# EAGLE design SideXSolarPanel (EAGLE 6.6.0)
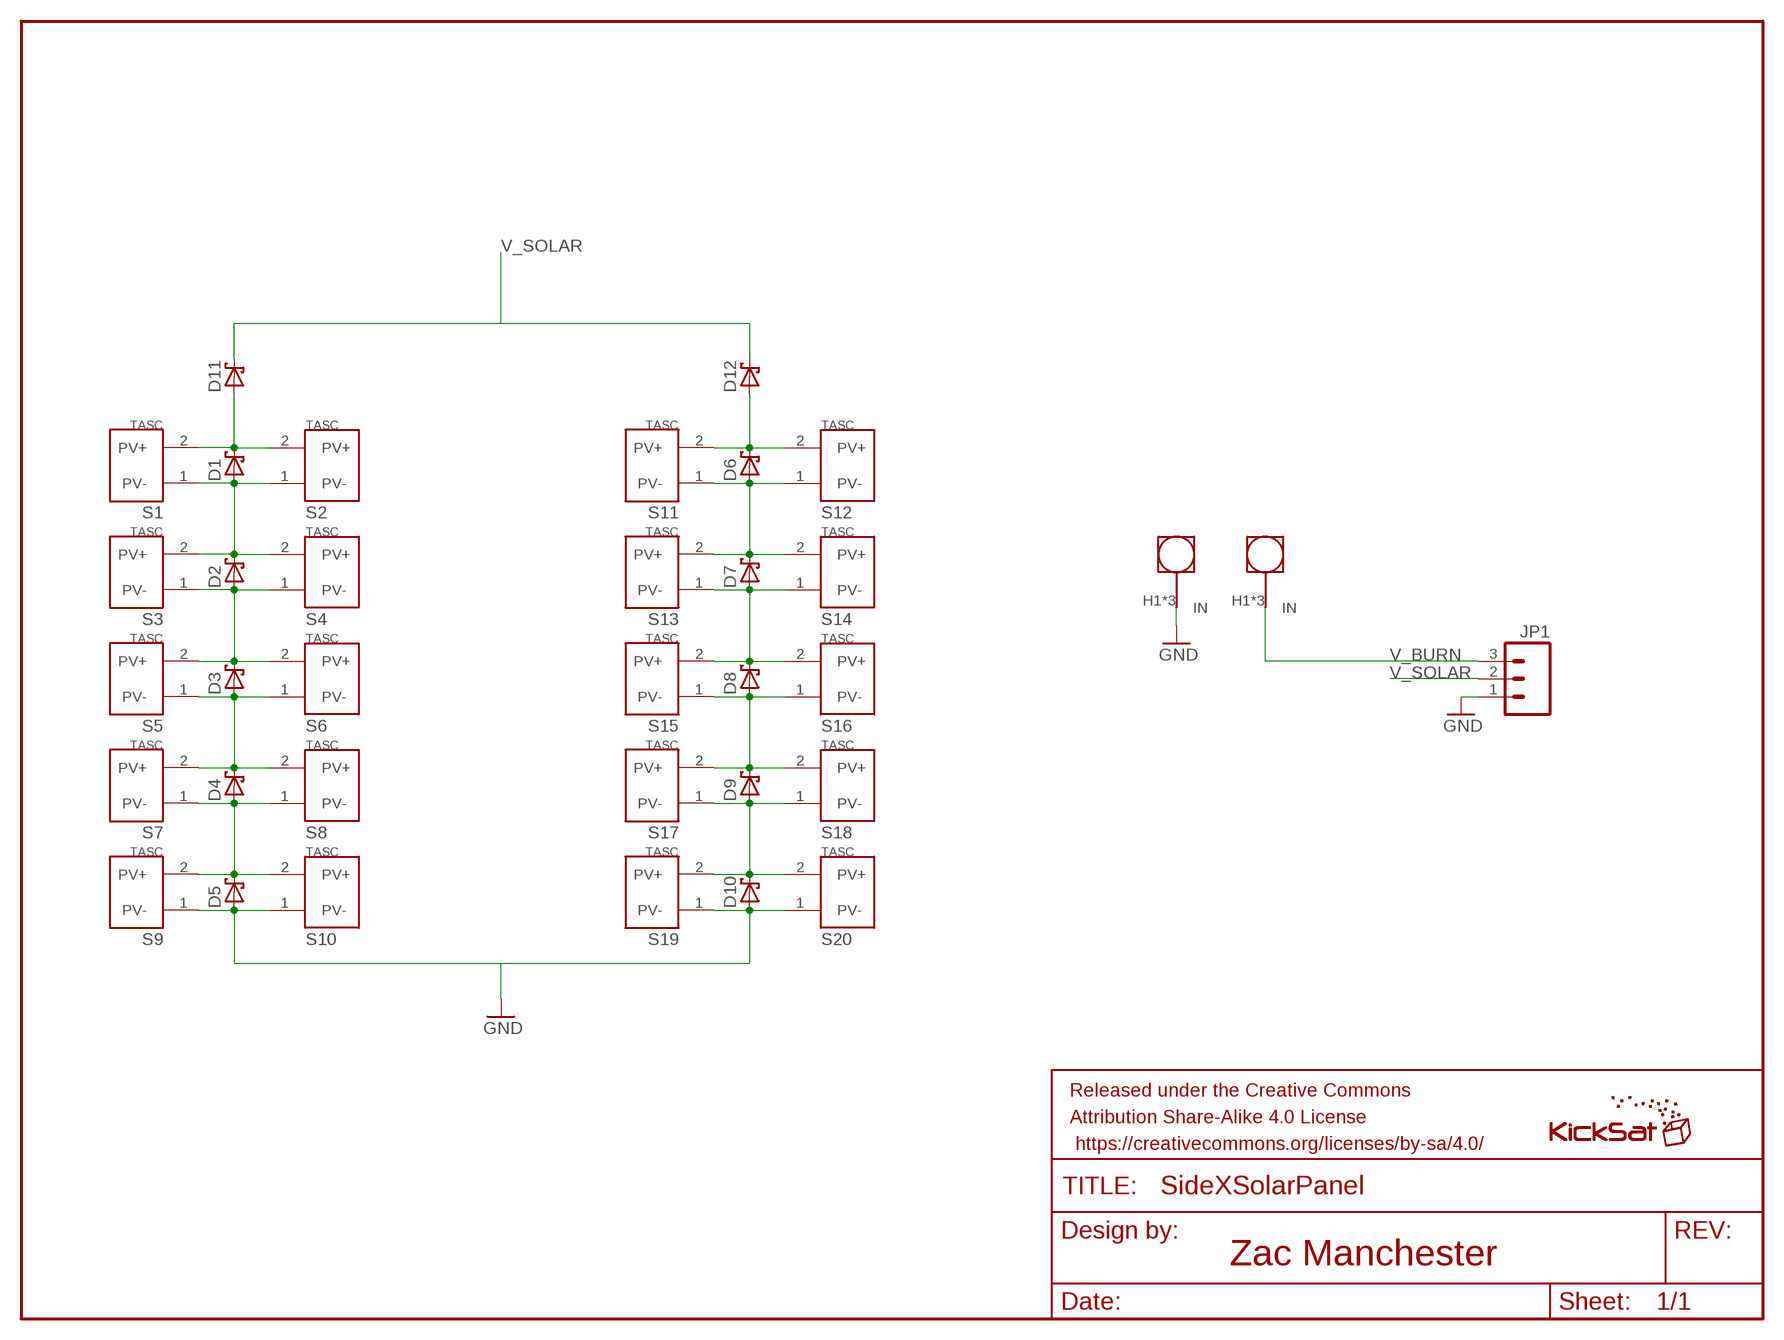
[diagram p0: schematic, sheet 1]

## Parts
D1  SB_DIODE  [SB_DIODE]
D2  SB_DIODE  [SB_DIODE]
D3  SB_DIODE  [SB_DIODE]
D4  SB_DIODE  [SB_DIODE]
D5  SB_DIODE  [SB_DIODE]
D6  SB_DIODE  [SB_DIODE]
D7  SB_DIODE  [SB_DIODE]
D8  SB_DIODE  [SB_DIODE]
D9  SB_DIODE  [SB_DIODE]
D10  SB_DIODE  [SB_DIODE]
D11  SB_DIODE  [SB_DIODE]
D12  SB_DIODE  [SB_DIODE]
FRAME1  FRAME-LETTER  [CREATIVE_COMMONS]
JP1  M03POLAR_LOCK  [MOLEX-1X3_LOCK]
S1  SOLAR_CELL  [SOLAR_CELL]
S2  SOLAR_CELL  [SOLAR_CELL]
S3  SOLAR_CELL  [SOLAR_CELL]
S4  SOLAR_CELL  [SOLAR_CELL]
S5  SOLAR_CELL  [SOLAR_CELL]
S6  SOLAR_CELL  [SOLAR_CELL]
S7  SOLAR_CELL  [SOLAR_CELL]
S8  SOLAR_CELL  [SOLAR_CELL]
S9  SOLAR_CELL  [SOLAR_CELL]
S10  SOLAR_CELL  [SOLAR_CELL]
S11  SOLAR_CELL  [SOLAR_CELL]
S12  SOLAR_CELL  [SOLAR_CELL]
S13  SOLAR_CELL  [SOLAR_CELL]
S14  SOLAR_CELL  [SOLAR_CELL]
S15  SOLAR_CELL  [SOLAR_CELL]
S16  SOLAR_CELL  [SOLAR_CELL]
S17  SOLAR_CELL  [SOLAR_CELL]
S18  SOLAR_CELL  [SOLAR_CELL]
S19  SOLAR_CELL  [SOLAR_CELL]
S20  SOLAR_CELL  [SOLAR_CELL]
U$1  BURNER  [BURNER]
U$2  BURNER  [BURNER]
U$3  KICKSAT_LOGO  [KICKSAT_LOGO]

## Nets
GND: D5.POS D10.POS JP1.1 S9.1(PV-) S10.1(PV-) S19.1(PV-) S20.1(PV-) U$2.H1(IN) U$2.H2(IN) U$2.H3(IN)
N$1: D6.POS D7.NEG S11.1(PV-) S12.1(PV-) S13.2(PV+) S14.2(PV+)
N$5: D6.NEG D12.POS S11.2(PV+) S12.2(PV+)
N$7: D7.POS D8.NEG S13.1(PV-) S14.1(PV-) S15.2(PV+) S16.2(PV+)
N$9: D1.NEG D11.POS S1.2(PV+) S2.2(PV+)
N$36: D8.POS D9.NEG S15.1(PV-) S16.1(PV-) S17.2(PV+) S18.2(PV+)
N$37: D2.POS D3.NEG S3.1(PV-) S4.1(PV-) S5.2(PV+) S6.2(PV+)
N$39: D3.POS D4.NEG S5.1(PV-) S6.1(PV-) S7.2(PV+) S8.2(PV+)
N$41: D9.POS D10.NEG S17.1(PV-) S18.1(PV-) S19.2(PV+) S20.2(PV+)
N$45: D1.POS D2.NEG S1.1(PV-) S2.1(PV-) S3.2(PV+) S4.2(PV+)
N$50: D4.POS D5.NEG S7.1(PV-) S8.1(PV-) S9.2(PV+) S10.2(PV+)
V_BURN: JP1.3 U$1.H1(IN) U$1.H2(IN) U$1.H3(IN)
V_SOLAR: D11.NEG D12.NEG JP1.2

## Notes on the sheet
- Zac Manchester

## Library data of the parts
D1-D12 = Solar:SB_DIODE
FRAME1 = SparkFun-Aesthetics:FRAME-LETTER: Schematic Frame Standard 8.5x11 US Letter frame
JP1 = SparkFun-Connectors:M03: Header 3 Standard 3-pin 0.1" header. Use with straight break away headers (SKU : PRT-00116), right angle break away headers (PRT-00553), swiss pins (PRT-00743), machine pins (PRT-00117), and female headers (PRT-00115). Molex polarized connector foot print use with SKU : PRT-08232 with associated crimp pins and housings.
S1-S20 = Solar:SOLAR_CELL
U$1 U$2 = Burner:BURNER
U$3 = KickSat-Logo:KICKSAT_LOGO

## Board
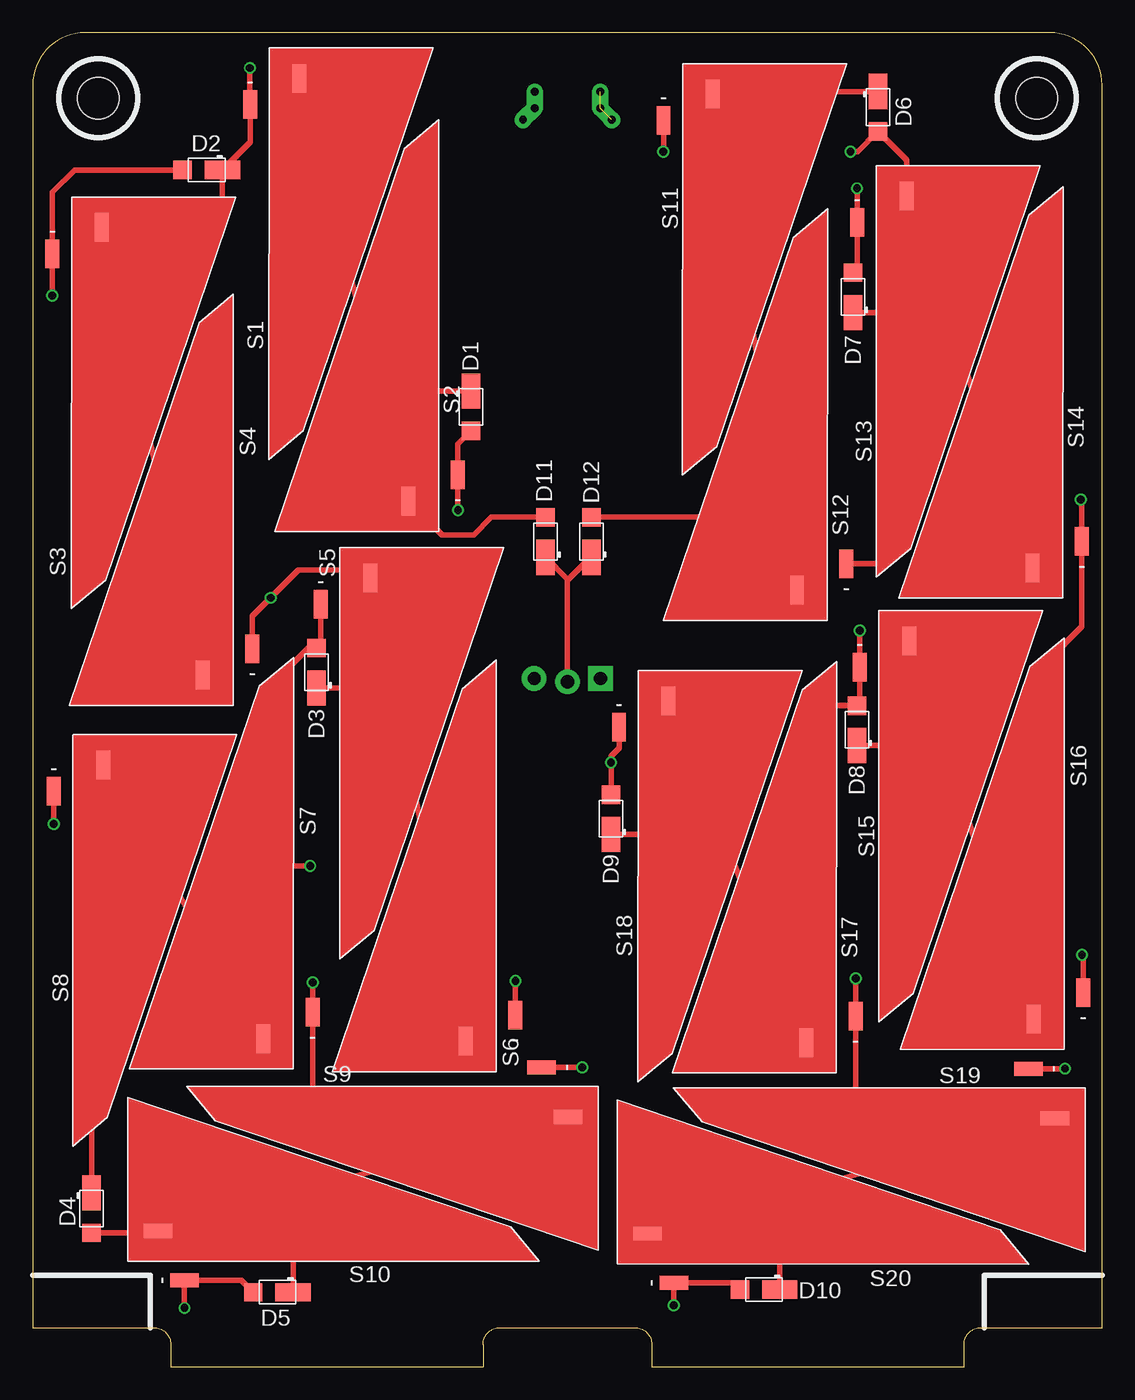
[diagram p1: board, top side]
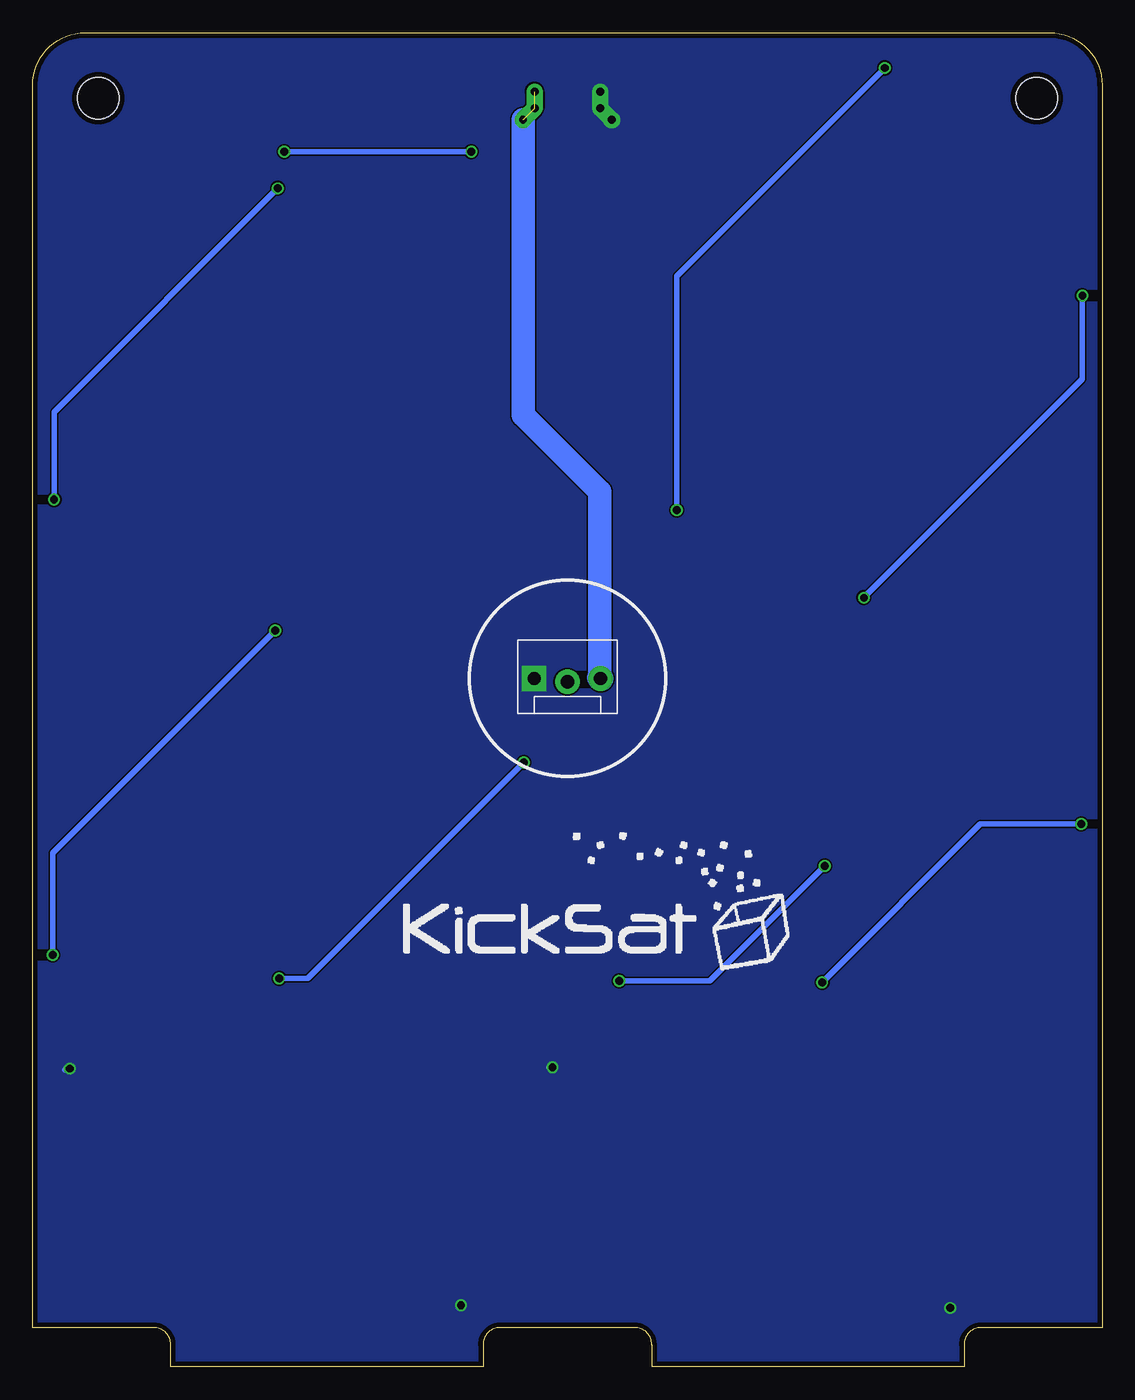
[diagram p2: board, bottom side, seen from below]

Size 81.73 x 102 mm. Coordinates in mm from the lower left corner, seen from the top.
Outline: 81.73,3 81.73,98 arc90 77.73,102 4,102 arc90 0,98 0,3 9.25,3 arc-90 10.55,1.7 10.55,0 34.41,0 34.41,1.7 arc-90 35.72,3 46.02,3 arc-90 47.31,1.7 47.31,0 71.18,0 71.18,1.7 arc-90 72.48,3 81.73,3
Copper layers (1*2*15*16): Top 0.035559375mm / dielectric 0.17018125mm / Route2 0.01778125mm / dielectric 47mil / Route15 0.01778125mm / dielectric 0.17018125mm / Bottom 0.035559375mm
Design rules "OSHPark-4layer": minimum track width 5mil, minimum drill 10mil, track to track 5mil, track to pad 5mil, pad to pad 5mil, via to via 5mil, smd to smd 5mil, copper to edge 15mil, drill to drill 6mil, minimum pad ring 4mil, minimum via ring 4mil, stop-mask expansion 4mil, vias tented up to drill 0mil, thermal gap 10mil
Holes 3.2 mm at 5,97 76.73,97

### Footprints (pad centres in the part's own frame; a part is rotated, then mirrored left to right if it is on the bottom)
SB_DIODE = smd 2.7 x 1.4: NEG -1.2,0 | smd 1.4 x 1.4: POS 1.85,0
MOLEX-1X3_LOCK = drill 1.016 pad 1.88 square: 1 0,0.127 | drill 1.016 pad 1.88: 2 2.54,-0.127; 3 5.08,0.127
SOLAR_CELL = smd 1.067 x 2.184: 1 -1.589,2.999; 2 2.187,5.011
BURNER = drill 0.6 pad 1.27 offset: H1 0,0; H2 1.27,0 | drill 0.6 pad 1.27: H3 2.159,0.889

### Placement (x,y rotation side)
D1  33.5,73.4 270 top
D2  13.3,91.5 180 top
D3  21.7,53.1 90 top
D4  4.5,12.1 270 top
D5  18.7,5.7 180 top
D6  64.6,96.3 270 top
D7  62.7,81.8 90 top
D8  63,48.7 90 top
D9  44.2,41.9 90 top
D10  55.9,5.9 180 top
D11  39.2,63.1 90 top
D12  42.7,63.1 90 top
FRAME1  20.8,-7.6 0 top  (outside the outline)
JP1  43.41,52.5 0 bottom
S1  18.2,93.5 0 top
S2  30.9,71.2 180 top
S3  3.1,82.1 0 top
S4  15.2,57.9 180 top
S5  23.6,55.3 0 top
S6  35.3,29.9 180 top
S7  19.8,30.1 180 top
S8  3.2,41 0 top
S9  35.9,21.3 270 top
S10  14.6,8.2 90 top
S11  49.8,92.3 0 top
S12  60.6,64.4 180 top
S13  64.6,84.5 0 top
S14  78.6,66.1 180 top
S15  64.8,50.5 0 top
S16  78.7,31.6 180 top
S17  61.3,29.8 180 top
S18  46.4,45.9 0 top
S19  73.1,21.2 270 top
S20  52,8 90 top
U$1  43.37,97.5 270 top
U$2  38.37,97.5 270 bottom
U$3  53.9,30.1 0 bottom

### Tracks (layer width: path | path; a pad name or v marks a point on that pad's centre or on a via)
GND  (via drill 0.6)
  Top 0.406: v11.6,4.5 S10.1 15.94,6.61 D5.POS | S9.1 41.99,22.89 v42,22.9 | v49,4.7 S20.1 53.54,6.41 D10.POS | S19.1 78.89,22.79 v78.9,22.8
  Bottom 0.406: v11.6,4.5 11.6,4.4 11.7,4.3 | v42,22.9 42.3,22.9 | v49,4.7 49.2,4.5 | v78.9,22.8 79.2,22.8 79.3,22.7
  pour Bottom (no thermals): 81.73,3 81.73,98 arc90 77.73,102 4,102 arc90 0,98 0,3 10.5,3 10.5,0 34.4,0 34.4,3 47.3,3 47.3,0 71.1,0 71.1,3
N$1  (via drill 0.6)
  Top 0.406: S14.2 70.15,79.58 | 70.15,79.58 69.93,80.24 | 69.93,80.24 S13.2 66.79,92.26 D6.POS 63.05,92.9 v62.5,92.9 | D7.NEG 69.57,80.6 69.93,80.24 | S12.1 64.5,61.4 65.6,62.5 65.6,72.47 70.8,77.67 70.8,78.93 70.15,79.58 | S11.1 48.21,92.91 v48.2,92.9
  Bottom 0.406: v48.2,92.9 v62.5,92.9
N$5
  Top 0.406: S12.2 57.38,65.48 | 57.38,65.48 S11.2 52.18,97.5 D6.NEG | D12.POS 56.85,64.95 57.38,65.48
N$7  (via drill 0.6)
  Top 0.406: S15.2 69.16,48.92 | 69.16,48.92 73.27,36.43 | 73.27,36.43 S16.2 | D8.NEG 67.74,47.5 69.16,48.92 | 73.27,36.43 77.6,40.75 77.6,54 80.19,56.59 S14.1 80.19,66.21 v80.1,66.3 | D7.POS 63.01,83.96 S13.1 v63,90.1
  Bottom 0.406: v80.1,66.3 80.1,73 v63,90.1
N$9
  Top 0.406: S1.2 26.21,75.9 | 26.21,75.9 S2.2 31.3,63.6 33.7,63.6 35.05,64.95 D11.POS | D1.NEG 27.51,74.6 26.21,75.9
N$36  (via drill 0.6)
  Top 0.406: S18.2 52.73,40.63 | 52.73,40.63 54.96,35.08 | 54.96,35.08 S17.2 | D9.NEG 52.66,40.7 52.73,40.63 | 54.96,35.08 59.9,40.02 59.9,50.5 59.95,50.55 D8.POS 63.21,50.76 S15.1 v63.2,56.3 | S16.1 80.29,31.41 v80.2,31.5
  Bottom 0.406: v80.2,31.5 80.2,39.3 v63.2,56.3
N$37  (via drill 0.6)
  Top 0.406: 27.4,52.5 S5.2 25.2,60.9 20.3,60.9 v18.2,58.8 16.79,57.39 S4.1 | 27.4,52.5 S6.2 | D3.NEG 26.8,51.9 27.4,52.5 | v1.5,81.9 1.51,81.91 S3.1 1.51,89.81 3.2,91.5 D2.POS
  Bottom 0.406: v1.5,81.9 1.5,75.5 v18.2,58.8
N$39  (via drill 0.6)
  Top 0.406: D4.NEG 4.5,45.12 S8.2 12.89,33.18 | 12.89,33.18 13.2,32.64 | 13.2,32.64 S7.2 | S5.1 22.01,55.26 D3.POS 21.05,54.95 18.9,52.8 18.9,38.33 13.2,32.64 | S6.1 v36.89,29.49 v36.9,29.5 | v21.2,38.3 18.01,38.3 12.89,33.18
  Bottom 0.406: v36.9,29.5 30,29.5 v21.2,38.3
N$41  (via drill 0.6)
  Top 0.406: S20.2 57.75,13.24 | 57.75,13.24 64.74,15.22 | 64.74,15.22 S19.2 | D10.NEG 57.1,12.59 57.75,13.24 | 64.74,15.22 62.89,17.07 S17.1 v62.89,29.69 v62.9,29.7 | S18.1 44.81,47.3 44.2,46.69 v44.2,46.2 D9.POS
  Bottom 0.406: v62.9,29.7 60.7,29.7 v44.2,46.2
N$45  (via drill 0.6)
  Top 0.406: S4.2 S3.2 13.1,87.1 14.5,88.5 D2.NEG 16.61,93.61 S1.1 v16.6,99.3 | D1.POS 32.49,70.54 S2.1 32.49,65.51 v32.5,65.5
  Bottom 0.406: v32.5,65.5 32.5,83.4 v16.6,99.3
N$50  (via drill 0.6)
  Top 0.406: S10.2 16.06,12.19 | 16.06,12.19 18.21,12.79 | 18.21,12.79 27.37,15.34 | 27.37,15.34 S9.2 | D5.NEG 19.9,11.1 18.21,12.79 | 27.37,15.34 21.39,21.32 S7.1 21.4,27.11 v21.4,29.4 | D4.POS 14.12,10.25 16.06,12.19 | S8.1 1.61,41.51 v1.6,41.5
  Bottom 0.406: v1.6,41.5 9.3,41.5 v21.4,29.4
V_BURN  (2 unrouted)
  Bottom 1.778: U$1.H3 44.25,72.75 38.4,66.9 38.4,52.7
  Bottom 1.93: 38.4,52.7 JP1.3
V_SOLAR
  Top 0.406: JP1.2 40.87,60.1 | 40.87,60.1 40.87,60.23 D11.NEG | D12.NEG 42.66,61.9 40.87,60.1